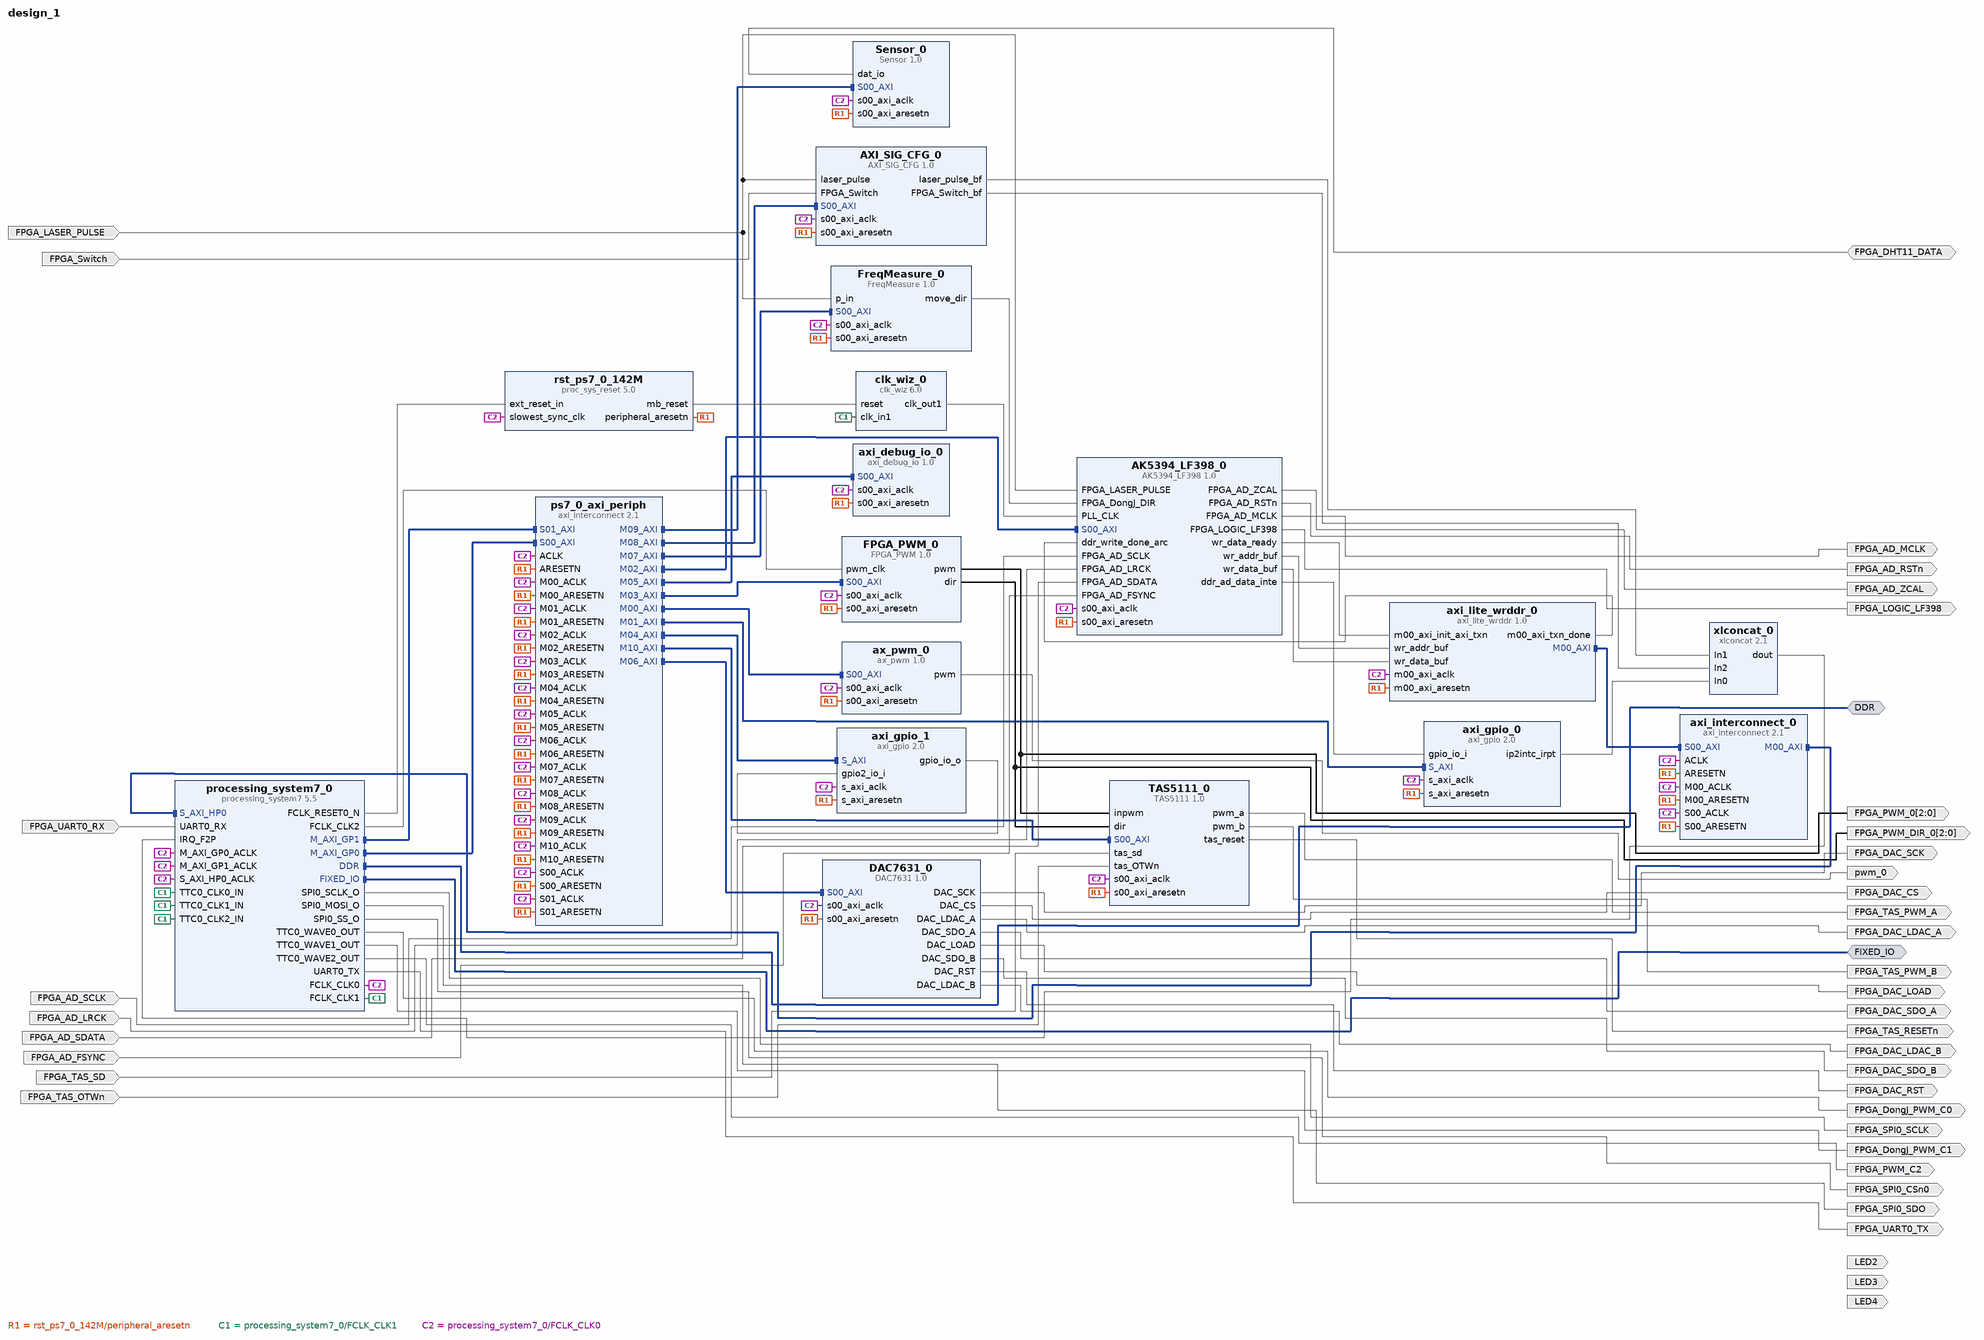
[diagram p0: block diagram of the top level]
# Vivado block design design_1, xc7z020clg484-2, Vivado 2018.3
create_bd_design design_1

create_bd_intf_port -mode Master -vlnv xilinx.com:interface:ddrx_rtl:1.0 DDR
create_bd_intf_port -mode Master -vlnv xilinx.com:display_processing_system7:fixedio_rtl:1.0 FIXED_IO
create_bd_port -dir O pwm_0
create_bd_port -dir I FPGA_AD_SCLK
create_bd_port -dir I FPGA_AD_LRCK
create_bd_port -dir I FPGA_AD_SDATA
create_bd_port -dir I FPGA_AD_FSYNC
create_bd_port -dir O FPGA_LOGIC_LF398
create_bd_port -dir O FPGA_AD_MCLK
create_bd_port -dir O FPGA_AD_ZCAL
create_bd_port -dir O -type rst FPGA_AD_RSTn
create_bd_port -dir I FPGA_LASER_PULSE
create_bd_port -dir O FPGA_SPI0_SCLK
create_bd_port -dir O FPGA_SPI0_SDO
create_bd_port -dir O FPGA_SPI0_CSn0
create_bd_port -dir O FPGA_UART0_TX
create_bd_port -dir I FPGA_UART0_RX
create_bd_port -dir O LED2
create_bd_port -dir O LED3
create_bd_port -dir O LED4
create_bd_port -dir O FPGA_DongJ_PWM_C0
create_bd_port -dir O FPGA_DongJ_PWM_C1
create_bd_port -dir O FPGA_PWM_C2
create_bd_port -dir O -from 2 -to 0 FPGA_PWM_0
create_bd_port -dir O -from 2 -to 0 FPGA_PWM_DIR_0
create_bd_port -dir I FPGA_Switch
create_bd_port -dir IO FPGA_DHT11_DATA
create_bd_port -dir O FPGA_DAC_SCK
create_bd_port -dir O FPGA_DAC_SDO_A
create_bd_port -dir O FPGA_DAC_SDO_B
create_bd_port -dir O FPGA_DAC_CS
create_bd_port -dir O -type rst FPGA_DAC_RST
create_bd_port -dir O FPGA_DAC_LOAD
create_bd_port -dir O FPGA_DAC_LDAC_A
create_bd_port -dir O FPGA_DAC_LDAC_B
create_bd_port -dir O FPGA_TAS_PWM_A
create_bd_port -dir O FPGA_TAS_PWM_B
create_bd_port -dir O -type rst FPGA_TAS_RESETn
create_bd_port -dir I FPGA_TAS_SD
create_bd_port -dir I FPGA_TAS_OTWn

create_bd_cell -type ip -vlnv xilinx.com:ip:processing_system7:5.5 processing_system7_0
set_property -dict [list \
  CONFIG.PCW_APU_PERIPHERAL_FREQMHZ 666.666666 \
  CONFIG.PCW_CORE0_IRQ_INTR 1 \
  CONFIG.PCW_CPU_CPU_6X4X_MAX_RANGE 767 \
  CONFIG.PCW_ENET0_ENET0_IO {MIO 16 .. 27} \
  CONFIG.PCW_ENET0_GRP_MDIO_ENABLE 1 \
  CONFIG.PCW_ENET0_GRP_MDIO_IO {MIO 52 .. 53} \
  CONFIG.PCW_ENET0_PERIPHERAL_ENABLE 1 \
  CONFIG.PCW_ENET0_RESET_ENABLE 1 \
  CONFIG.PCW_ENET0_RESET_IO {MIO 7} \
  CONFIG.PCW_ENET_RESET_ENABLE 1 \
  CONFIG.PCW_ENET_RESET_SELECT {Share reset pin} \
  CONFIG.PCW_EN_CLK1_PORT 1 \
  CONFIG.PCW_EN_CLK2_PORT 1 \
  CONFIG.PCW_FCLK0_PERIPHERAL_CLKSRC {ARM PLL} \
  CONFIG.PCW_FCLK_CLK1_BUF TRUE \
  CONFIG.PCW_FPGA0_PERIPHERAL_FREQMHZ 150 \
  CONFIG.PCW_FPGA1_PERIPHERAL_FREQMHZ 50 \
  CONFIG.PCW_FPGA2_PERIPHERAL_FREQMHZ 200 \
  CONFIG.PCW_FPGA_FCLK1_ENABLE 1 \
  CONFIG.PCW_FPGA_FCLK2_ENABLE 1 \
  CONFIG.PCW_GPIO_MIO_GPIO_ENABLE 1 \
  CONFIG.PCW_GPIO_MIO_GPIO_IO MIO \
  CONFIG.PCW_I2C_RESET_ENABLE 1 \
  CONFIG.PCW_IRQ_F2P_INTR 1 \
  CONFIG.PCW_PERIPHERAL_BOARD_PRESET None \
  CONFIG.PCW_PRESET_BANK1_VOLTAGE {LVCMOS 1.8V} \
  CONFIG.PCW_QSPI_GRP_SINGLE_SS_ENABLE 1 \
  CONFIG.PCW_QSPI_GRP_SINGLE_SS_IO {MIO 1 .. 6} \
  CONFIG.PCW_QSPI_PERIPHERAL_ENABLE 1 \
  CONFIG.PCW_QSPI_QSPI_IO {MIO 1 .. 6} \
  CONFIG.PCW_SD0_PERIPHERAL_ENABLE 0 \
  CONFIG.PCW_SINGLE_QSPI_DATA_MODE x4 \
  CONFIG.PCW_SPI0_PERIPHERAL_ENABLE 1 \
  CONFIG.PCW_SPI0_SPI0_IO EMIO \
  CONFIG.PCW_S_AXI_HP0_DATA_WIDTH 32 \
  CONFIG.PCW_S_AXI_HP1_DATA_WIDTH 32 \
  CONFIG.PCW_S_AXI_HP2_DATA_WIDTH 32 \
  CONFIG.PCW_TTC0_CLK0_PERIPHERAL_CLKSRC External \
  CONFIG.PCW_TTC0_CLK0_PERIPHERAL_FREQMHZ 50 \
  CONFIG.PCW_TTC0_CLK1_PERIPHERAL_CLKSRC External \
  CONFIG.PCW_TTC0_CLK1_PERIPHERAL_FREQMHZ 50 \
  CONFIG.PCW_TTC0_CLK2_PERIPHERAL_CLKSRC External \
  CONFIG.PCW_TTC0_CLK2_PERIPHERAL_FREQMHZ 50 \
  CONFIG.PCW_TTC0_PERIPHERAL_ENABLE 1 \
  CONFIG.PCW_TTC0_TTC0_IO EMIO \
  CONFIG.PCW_UART0_PERIPHERAL_ENABLE 1 \
  CONFIG.PCW_UART0_UART0_IO EMIO \
  CONFIG.PCW_UART1_PERIPHERAL_ENABLE 1 \
  CONFIG.PCW_UART1_UART1_IO {MIO 12 .. 13} \
  CONFIG.PCW_UART_PERIPHERAL_FREQMHZ 100 \
  CONFIG.PCW_UIPARAM_DDR_FREQ_MHZ 533.333333 \
  CONFIG.PCW_UIPARAM_DDR_PARTNO {MT41J256M16 RE-125} \
  CONFIG.PCW_UIPARAM_GENERATE_SUMMARY NONE \
  CONFIG.PCW_USB0_PERIPHERAL_ENABLE 0 \
  CONFIG.PCW_USB_RESET_ENABLE 1 \
  CONFIG.PCW_USE_FABRIC_INTERRUPT 1 \
  CONFIG.PCW_USE_M_AXI_GP1 1 \
  CONFIG.PCW_USE_S_AXI_HP0 1 \
] [get_bd_cells processing_system7_0]
# 507 more settings of processing_system7_0 are not shown: defaults, MIO pin electricals, DDR timing, and values the tool derives
create_bd_cell -type ip -vlnv xilinx.com:user:ax_pwm:1.0 ax_pwm_0
create_bd_cell -type ip -vlnv xilinx.com:ip:axi_gpio:2.0 axi_gpio_0
set_property -dict [list \
  CONFIG.C_ALL_INPUTS 1 \
  CONFIG.C_GPIO_WIDTH 1 \
  CONFIG.C_INTERRUPT_PRESENT 1 \
  CONFIG.C_IS_DUAL 0 \
] [get_bd_cells axi_gpio_0]
create_bd_cell -type ip -vlnv xilinx.com:ip:proc_sys_reset:5.0 rst_ps7_0_142M
create_bd_cell -type ip -vlnv xilinx.com:ip:axi_interconnect:2.1 axi_interconnect_0
set_property -dict {CONFIG.M00_HAS_DATA_FIFO 0 CONFIG.NUM_MI 1 CONFIG.NUM_SI 1} [get_bd_cells axi_interconnect_0]
create_bd_cell -type ip -vlnv xilinx.com:ip:axi_interconnect:2.1 ps7_0_axi_periph
set_property -dict [list \
  CONFIG.M00_HAS_DATA_FIFO 1 \
  CONFIG.M01_HAS_DATA_FIFO 1 \
  CONFIG.M02_HAS_DATA_FIFO 1 \
  CONFIG.M03_HAS_DATA_FIFO 1 \
  CONFIG.M04_HAS_DATA_FIFO 1 \
  CONFIG.M05_HAS_DATA_FIFO 1 \
  CONFIG.M06_HAS_DATA_FIFO 1 \
  CONFIG.M07_HAS_DATA_FIFO 1 \
  CONFIG.M08_HAS_DATA_FIFO 1 \
  CONFIG.M09_HAS_DATA_FIFO 1 \
  CONFIG.NUM_MI 11 \
  CONFIG.NUM_SI 2 \
  CONFIG.S00_HAS_DATA_FIFO 1 \
  CONFIG.S00_HAS_REGSLICE 3 \
  CONFIG.S01_HAS_DATA_FIFO 1 \
  CONFIG.S01_HAS_REGSLICE 3 \
] [get_bd_cells ps7_0_axi_periph]
create_bd_cell -type ip -vlnv xilinx.com:ip:clk_wiz:6.0 clk_wiz_0
set_property -dict [list \
  CONFIG.CLKIN1_JITTER_PS 200.0 \
  CONFIG.CLKOUT1_DRIVES BUFG \
  CONFIG.CLKOUT1_JITTER 175.090 \
  CONFIG.CLKOUT1_PHASE_ERROR 134.075 \
  CONFIG.CLKOUT1_REQUESTED_OUT_FREQ 12.288 \
  CONFIG.CLKOUT2_DRIVES BUFG \
  CONFIG.CLKOUT3_DRIVES BUFG \
  CONFIG.CLKOUT4_DRIVES BUFG \
  CONFIG.CLKOUT5_DRIVES BUFG \
  CONFIG.CLKOUT6_DRIVES BUFG \
  CONFIG.CLKOUT7_DRIVES BUFG \
  CONFIG.FEEDBACK_SOURCE FDBK_AUTO \
  CONFIG.MMCM_CLKFBOUT_MULT_F 29 \
  CONFIG.MMCM_CLKIN1_PERIOD 20.000 \
  CONFIG.MMCM_CLKIN2_PERIOD 10.0 \
  CONFIG.MMCM_CLKOUT0_DIVIDE_F 118 \
  CONFIG.MMCM_COMPENSATION INTERNAL \
  CONFIG.MMCM_DIVCLK_DIVIDE 1 \
  CONFIG.OVERRIDE_MMCM true \
  CONFIG.PRIMITIVE PLL \
  CONFIG.PRIM_IN_FREQ 50 \
  CONFIG.USE_LOCKED false \
] [get_bd_cells clk_wiz_0]
create_bd_cell -type ip -vlnv xilinx.com:ip:axi_gpio:2.0 axi_gpio_1
set_property -dict {CONFIG.C_ALL_INPUTS_2 1 CONFIG.C_ALL_OUTPUTS 1 CONFIG.C_IS_DUAL 1} [get_bd_cells axi_gpio_1]
create_bd_cell -type ip -vlnv xilinx.com:user:axi_lite_wrddr:1.0 axi_lite_wrddr_0
set_property -dict [list \
  CONFIG.C_M00_AXI_TARGET_SLAVE_BASE_ADDR 0x04000000 \
  CONFIG.C_M00_AXI_TRANSACTIONS_NUM 3 \
] [get_bd_cells axi_lite_wrddr_0]
create_bd_cell -type ip -vlnv xilinx.com:user:axi_debug_io:1.0 axi_debug_io_0
create_bd_cell -type ip -vlnv xilinx.com:user:FPGA_PWM:1.0 FPGA_PWM_0
create_bd_cell -type ip -vlnv xilinx.com:user:FreqMeasure:1.0 FreqMeasure_0
create_bd_cell -type ip -vlnv xilinx.com:ip:xlconcat:2.1 xlconcat_0
set_property -dict {CONFIG.NUM_PORTS 3} [get_bd_cells xlconcat_0]
create_bd_cell -type ip -vlnv xilinx.com:user:AXI_SIG_CFG:1.0 AXI_SIG_CFG_0
create_bd_cell -type ip -vlnv xilinx.com:user:AK5394_LF398:1.0 AK5394_LF398_0
set_property -dict {CONFIG.DDR_BASE_ADDR 0x04000000} [get_bd_cells AK5394_LF398_0]
create_bd_cell -type ip -vlnv xilinx.com:user:Sensor:1.0 Sensor_0
create_bd_cell -type ip -vlnv xilinx.com:user:DAC7631:1.0 DAC7631_0
create_bd_cell -type ip -vlnv xilinx.com:user:TAS5111:1.0 TAS5111_0

# ---- connections ----

connect_bd_intf_net [get_bd_intf_pins processing_system7_0/M_AXI_GP1] [get_bd_intf_pins ps7_0_axi_periph/S01_AXI]
connect_bd_intf_net [get_bd_intf_ports DDR] [get_bd_intf_pins processing_system7_0/DDR]
connect_bd_intf_net [get_bd_intf_pins ps7_0_axi_periph/M08_AXI] [get_bd_intf_pins AXI_SIG_CFG_0/S00_AXI]
connect_bd_intf_net [get_bd_intf_pins axi_lite_wrddr_0/M00_AXI] [get_bd_intf_pins axi_interconnect_0/S00_AXI]
connect_bd_intf_net [get_bd_intf_pins ps7_0_axi_periph/M01_AXI] [get_bd_intf_pins axi_gpio_0/S_AXI]
connect_bd_intf_net [get_bd_intf_ports FIXED_IO] [get_bd_intf_pins processing_system7_0/FIXED_IO]
connect_bd_intf_net [get_bd_intf_pins ps7_0_axi_periph/M03_AXI] [get_bd_intf_pins FPGA_PWM_0/S00_AXI]
connect_bd_intf_net [get_bd_intf_pins axi_interconnect_0/M00_AXI] [get_bd_intf_pins processing_system7_0/S_AXI_HP0]
connect_bd_intf_net [get_bd_intf_pins processing_system7_0/M_AXI_GP0] [get_bd_intf_pins ps7_0_axi_periph/S00_AXI]
connect_bd_intf_net [get_bd_intf_pins ps7_0_axi_periph/M04_AXI] [get_bd_intf_pins axi_gpio_1/S_AXI]
connect_bd_intf_net [get_bd_intf_pins ps7_0_axi_periph/M05_AXI] [get_bd_intf_pins axi_debug_io_0/S00_AXI]
connect_bd_intf_net [get_bd_intf_pins ps7_0_axi_periph/M07_AXI] [get_bd_intf_pins FreqMeasure_0/S00_AXI]
connect_bd_intf_net [get_bd_intf_pins ps7_0_axi_periph/M06_AXI] [get_bd_intf_pins DAC7631_0/S00_AXI]
connect_bd_intf_net [get_bd_intf_pins ps7_0_axi_periph/M02_AXI] [get_bd_intf_pins AK5394_LF398_0/S00_AXI]
connect_bd_intf_net [get_bd_intf_pins ps7_0_axi_periph/M09_AXI] [get_bd_intf_pins Sensor_0/S00_AXI]
connect_bd_intf_net [get_bd_intf_pins ps7_0_axi_periph/M00_AXI] [get_bd_intf_pins ax_pwm_0/S00_AXI]
connect_bd_intf_net [get_bd_intf_pins ps7_0_axi_periph/M10_AXI] [get_bd_intf_pins TAS5111_0/S00_AXI]
connect_bd_net [get_bd_pins ax_pwm_0/pwm] [get_bd_ports pwm_0]
connect_bd_net [get_bd_ports FPGA_AD_SCLK] [get_bd_pins AK5394_LF398_0/FPGA_AD_SCLK]
connect_bd_net [get_bd_ports FPGA_AD_LRCK] [get_bd_pins AK5394_LF398_0/FPGA_AD_LRCK]
connect_bd_net [get_bd_ports FPGA_AD_SDATA] [get_bd_pins AK5394_LF398_0/FPGA_AD_SDATA]
connect_bd_net [get_bd_ports FPGA_AD_FSYNC] [get_bd_pins AK5394_LF398_0/FPGA_AD_FSYNC]
connect_bd_net [get_bd_pins AK5394_LF398_0/FPGA_LOGIC_LF398] [get_bd_ports FPGA_LOGIC_LF398]
connect_bd_net [get_bd_pins AK5394_LF398_0/FPGA_AD_ZCAL] [get_bd_ports FPGA_AD_ZCAL]
connect_bd_net [get_bd_pins AK5394_LF398_0/FPGA_AD_RSTn] [get_bd_ports FPGA_AD_RSTn]
connect_bd_net [get_bd_ports FPGA_LASER_PULSE] \
  [get_bd_pins FreqMeasure_0/p_in] [get_bd_pins AXI_SIG_CFG_0/laser_pulse] [get_bd_pins AK5394_LF398_0/FPGA_LASER_PULSE]
connect_bd_net [get_bd_pins processing_system7_0/SPI0_SCLK_O] [get_bd_ports FPGA_SPI0_SCLK]
connect_bd_net [get_bd_pins processing_system7_0/SPI0_MOSI_O] [get_bd_ports FPGA_SPI0_SDO]
connect_bd_net [get_bd_pins processing_system7_0/SPI0_SS_O] [get_bd_ports FPGA_SPI0_CSn0]
connect_bd_net [get_bd_ports FPGA_UART0_RX] [get_bd_pins processing_system7_0/UART0_RX]
connect_bd_net [get_bd_pins processing_system7_0/TTC0_WAVE0_OUT] [get_bd_ports FPGA_DongJ_PWM_C0]
connect_bd_net [get_bd_pins processing_system7_0/TTC0_WAVE1_OUT] [get_bd_ports FPGA_DongJ_PWM_C1]
connect_bd_net [get_bd_pins processing_system7_0/TTC0_WAVE2_OUT] [get_bd_ports FPGA_PWM_C2]
connect_bd_net [get_bd_pins processing_system7_0/FCLK_RESET0_N] [get_bd_pins rst_ps7_0_142M/ext_reset_in]
connect_bd_net [get_bd_pins rst_ps7_0_142M/peripheral_aresetn] \
  [get_bd_pins ax_pwm_0/s00_axi_aresetn] [get_bd_pins axi_gpio_0/s_axi_aresetn] [get_bd_pins axi_interconnect_0/S00_ARESETN] \
  [get_bd_pins axi_interconnect_0/M00_ARESETN] [get_bd_pins axi_interconnect_0/ARESETN] \
  [get_bd_pins ps7_0_axi_periph/S00_ARESETN] [get_bd_pins ps7_0_axi_periph/M00_ARESETN] \
  [get_bd_pins ps7_0_axi_periph/ARESETN] [get_bd_pins ps7_0_axi_periph/M01_ARESETN] \
  [get_bd_pins ps7_0_axi_periph/M02_ARESETN] [get_bd_pins ps7_0_axi_periph/M03_ARESETN] \
  [get_bd_pins axi_gpio_1/s_axi_aresetn] [get_bd_pins ps7_0_axi_periph/M04_ARESETN] \
  [get_bd_pins ps7_0_axi_periph/M05_ARESETN] [get_bd_pins axi_lite_wrddr_0/m00_axi_aresetn] \
  [get_bd_pins ps7_0_axi_periph/M06_ARESETN] [get_bd_pins axi_debug_io_0/s00_axi_aresetn] \
  [get_bd_pins FPGA_PWM_0/s00_axi_aresetn] [get_bd_pins ps7_0_axi_periph/S01_ARESETN] \
  [get_bd_pins ps7_0_axi_periph/M07_ARESETN] [get_bd_pins FreqMeasure_0/s00_axi_aresetn] \
  [get_bd_pins ps7_0_axi_periph/M08_ARESETN] [get_bd_pins AXI_SIG_CFG_0/s00_axi_aresetn] \
  [get_bd_pins AK5394_LF398_0/s00_axi_aresetn] [get_bd_pins Sensor_0/s00_axi_aresetn] \
  [get_bd_pins ps7_0_axi_periph/M09_ARESETN] [get_bd_pins DAC7631_0/s00_axi_aresetn] \
  [get_bd_pins ps7_0_axi_periph/M10_ARESETN] [get_bd_pins TAS5111_0/s00_axi_aresetn]
connect_bd_net [get_bd_pins processing_system7_0/FCLK_CLK1] \
  [get_bd_pins processing_system7_0/TTC0_CLK0_IN] [get_bd_pins processing_system7_0/TTC0_CLK1_IN] \
  [get_bd_pins processing_system7_0/TTC0_CLK2_IN] [get_bd_pins clk_wiz_0/clk_in1]
connect_bd_net [get_bd_pins processing_system7_0/FCLK_CLK0] \
  [get_bd_pins processing_system7_0/M_AXI_GP0_ACLK] [get_bd_pins processing_system7_0/S_AXI_HP0_ACLK] \
  [get_bd_pins axi_interconnect_0/M00_ACLK] [get_bd_pins axi_gpio_0/s_axi_aclk] [get_bd_pins rst_ps7_0_142M/slowest_sync_clk] \
  [get_bd_pins axi_interconnect_0/S00_ACLK] [get_bd_pins axi_interconnect_0/ACLK] [get_bd_pins ps7_0_axi_periph/ACLK] \
  [get_bd_pins ps7_0_axi_periph/S00_ACLK] [get_bd_pins ps7_0_axi_periph/M00_ACLK] [get_bd_pins ps7_0_axi_periph/M01_ACLK] \
  [get_bd_pins ps7_0_axi_periph/M02_ACLK] [get_bd_pins ps7_0_axi_periph/M03_ACLK] [get_bd_pins ax_pwm_0/s00_axi_aclk] \
  [get_bd_pins axi_gpio_1/s_axi_aclk] [get_bd_pins ps7_0_axi_periph/M04_ACLK] [get_bd_pins ps7_0_axi_periph/M05_ACLK] \
  [get_bd_pins axi_lite_wrddr_0/m00_axi_aclk] [get_bd_pins ps7_0_axi_periph/M06_ACLK] \
  [get_bd_pins axi_debug_io_0/s00_axi_aclk] [get_bd_pins FPGA_PWM_0/s00_axi_aclk] \
  [get_bd_pins processing_system7_0/M_AXI_GP1_ACLK] [get_bd_pins ps7_0_axi_periph/S01_ACLK] \
  [get_bd_pins ps7_0_axi_periph/M07_ACLK] [get_bd_pins FreqMeasure_0/s00_axi_aclk] [get_bd_pins ps7_0_axi_periph/M08_ACLK] \
  [get_bd_pins AXI_SIG_CFG_0/s00_axi_aclk] [get_bd_pins AK5394_LF398_0/s00_axi_aclk] [get_bd_pins Sensor_0/s00_axi_aclk] \
  [get_bd_pins ps7_0_axi_periph/M09_ACLK] [get_bd_pins DAC7631_0/s00_axi_aclk] [get_bd_pins ps7_0_axi_periph/M10_ACLK] \
  [get_bd_pins TAS5111_0/s00_axi_aclk]
connect_bd_net [get_bd_pins AK5394_LF398_0/wr_data_ready] [get_bd_pins axi_lite_wrddr_0/m00_axi_init_axi_txn]
connect_bd_net [get_bd_pins axi_lite_wrddr_0/m00_axi_txn_done] [get_bd_pins AK5394_LF398_0/ddr_write_done_arc]
connect_bd_net [get_bd_pins clk_wiz_0/clk_out1] [get_bd_pins AK5394_LF398_0/PLL_CLK]
connect_bd_net [get_bd_pins AK5394_LF398_0/FPGA_AD_MCLK] [get_bd_ports FPGA_AD_MCLK]
connect_bd_net [get_bd_pins rst_ps7_0_142M/mb_reset] [get_bd_pins clk_wiz_0/reset]
connect_bd_net [get_bd_pins FPGA_PWM_0/pwm] [get_bd_ports FPGA_PWM_0] [get_bd_pins TAS5111_0/inpwm]
connect_bd_net [get_bd_pins FPGA_PWM_0/dir] [get_bd_ports FPGA_PWM_DIR_0] [get_bd_pins TAS5111_0/dir]
connect_bd_net [get_bd_pins processing_system7_0/FCLK_CLK2] [get_bd_pins FPGA_PWM_0/pwm_clk]
connect_bd_net [get_bd_pins AK5394_LF398_0/wr_addr_buf] [get_bd_pins axi_lite_wrddr_0/wr_addr_buf]
connect_bd_net [get_bd_pins AK5394_LF398_0/wr_data_buf] [get_bd_pins axi_lite_wrddr_0/wr_data_buf]
connect_bd_net [get_bd_pins processing_system7_0/UART0_TX] [get_bd_ports FPGA_UART0_TX]
connect_bd_net [get_bd_pins axi_gpio_1/gpio_io_o] [get_bd_pins axi_gpio_1/gpio2_io_i]
connect_bd_net [get_bd_pins FreqMeasure_0/move_dir] [get_bd_pins AK5394_LF398_0/FPGA_DongJ_DIR]
connect_bd_net [get_bd_pins xlconcat_0/dout] [get_bd_pins processing_system7_0/IRQ_F2P]
connect_bd_net [get_bd_pins axi_gpio_0/ip2intc_irpt] [get_bd_pins xlconcat_0/In0]
connect_bd_net [get_bd_pins AXI_SIG_CFG_0/laser_pulse_bf] [get_bd_pins xlconcat_0/In1]
connect_bd_net [get_bd_pins AXI_SIG_CFG_0/FPGA_Switch_bf] [get_bd_pins xlconcat_0/In2]
connect_bd_net [get_bd_pins AK5394_LF398_0/ddr_ad_data_inte] [get_bd_pins axi_gpio_0/gpio_io_i]
connect_bd_net [get_bd_ports FPGA_Switch] [get_bd_pins AXI_SIG_CFG_0/FPGA_Switch]
connect_bd_net [get_bd_ports FPGA_DHT11_DATA] [get_bd_pins Sensor_0/dat_io]
connect_bd_net [get_bd_pins DAC7631_0/DAC_SCK] [get_bd_ports FPGA_DAC_SCK]
connect_bd_net [get_bd_pins DAC7631_0/DAC_SDO_A] [get_bd_ports FPGA_DAC_SDO_A]
connect_bd_net [get_bd_pins DAC7631_0/DAC_SDO_B] [get_bd_ports FPGA_DAC_SDO_B]
connect_bd_net [get_bd_pins DAC7631_0/DAC_CS] [get_bd_ports FPGA_DAC_CS]
connect_bd_net [get_bd_pins DAC7631_0/DAC_RST] [get_bd_ports FPGA_DAC_RST]
connect_bd_net [get_bd_pins DAC7631_0/DAC_LOAD] [get_bd_ports FPGA_DAC_LOAD]
connect_bd_net [get_bd_pins DAC7631_0/DAC_LDAC_A] [get_bd_ports FPGA_DAC_LDAC_A]
connect_bd_net [get_bd_pins DAC7631_0/DAC_LDAC_B] [get_bd_ports FPGA_DAC_LDAC_B]
connect_bd_net [get_bd_pins TAS5111_0/pwm_a] [get_bd_ports FPGA_TAS_PWM_A]
connect_bd_net [get_bd_pins TAS5111_0/pwm_b] [get_bd_ports FPGA_TAS_PWM_B]
connect_bd_net [get_bd_pins TAS5111_0/tas_reset] [get_bd_ports FPGA_TAS_RESETn]
connect_bd_net -net tas_sd_0_1 [get_bd_ports FPGA_TAS_SD] [get_bd_pins TAS5111_0/tas_sd]
connect_bd_net -net tas_OTWn_0_1 [get_bd_ports FPGA_TAS_OTWn] [get_bd_pins TAS5111_0/tas_OTWn]

# ---- address map ----
assign_bd_address -offset 0x00000000 -range 1G -target_address_space [get_bd_addr_spaces axi_lite_wrddr_0/M00_AXI] [get_bd_addr_segs processing_system7_0/S_AXI_HP0/HP0_DDR_LOWOCM]
assign_bd_address -offset 0x40000000 -range 4K -target_address_space [get_bd_addr_spaces processing_system7_0/Data] [get_bd_addr_segs AK5394_LF398_0/S00_AXI/S00_AXI_reg]
assign_bd_address -offset 0x40001000 -range 4K -target_address_space [get_bd_addr_spaces processing_system7_0/Data] [get_bd_addr_segs axi_gpio_1/S_AXI/Reg]
assign_bd_address -offset 0x40002000 -range 4K -target_address_space [get_bd_addr_spaces processing_system7_0/Data] [get_bd_addr_segs axi_gpio_0/S_AXI/Reg]
assign_bd_address -offset 0x40003000 -range 4K -target_address_space [get_bd_addr_spaces processing_system7_0/Data] [get_bd_addr_segs ax_pwm_0/S00_AXI/S00_AXI_reg]
assign_bd_address -offset 0x40004000 -range 4K -target_address_space [get_bd_addr_spaces processing_system7_0/Data] [get_bd_addr_segs FPGA_PWM_0/S00_AXI/S00_AXI_reg]
assign_bd_address -offset 0x40005000 -range 4K -target_address_space [get_bd_addr_spaces processing_system7_0/Data] [get_bd_addr_segs axi_debug_io_0/S00_AXI/S00_AXI_reg]
assign_bd_address -offset 0x40006000 -range 4K -target_address_space [get_bd_addr_spaces processing_system7_0/Data] [get_bd_addr_segs DAC7631_0/S00_AXI/S00_AXI_reg]
assign_bd_address -offset 0x40007000 -range 4K -target_address_space [get_bd_addr_spaces processing_system7_0/Data] [get_bd_addr_segs FreqMeasure_0/S00_AXI/S00_AXI_reg]
assign_bd_address -offset 0x40008000 -range 4K -target_address_space [get_bd_addr_spaces processing_system7_0/Data] [get_bd_addr_segs AXI_SIG_CFG_0/S00_AXI/S00_AXI_reg]
assign_bd_address -offset 0x40009000 -range 4K -target_address_space [get_bd_addr_spaces processing_system7_0/Data] [get_bd_addr_segs Sensor_0/S00_AXI/S00_AXI_reg]
assign_bd_address -offset 0x40010000 -range 4K -target_address_space [get_bd_addr_spaces processing_system7_0/Data] [get_bd_addr_segs TAS5111_0/S00_AXI/S00_AXI_reg]

validate_bd_design
save_bd_design
